# Altium schematic sheet Callisto Control Board.SchDoc
size A3; SheetNumber: 1; SheetTotal: 10
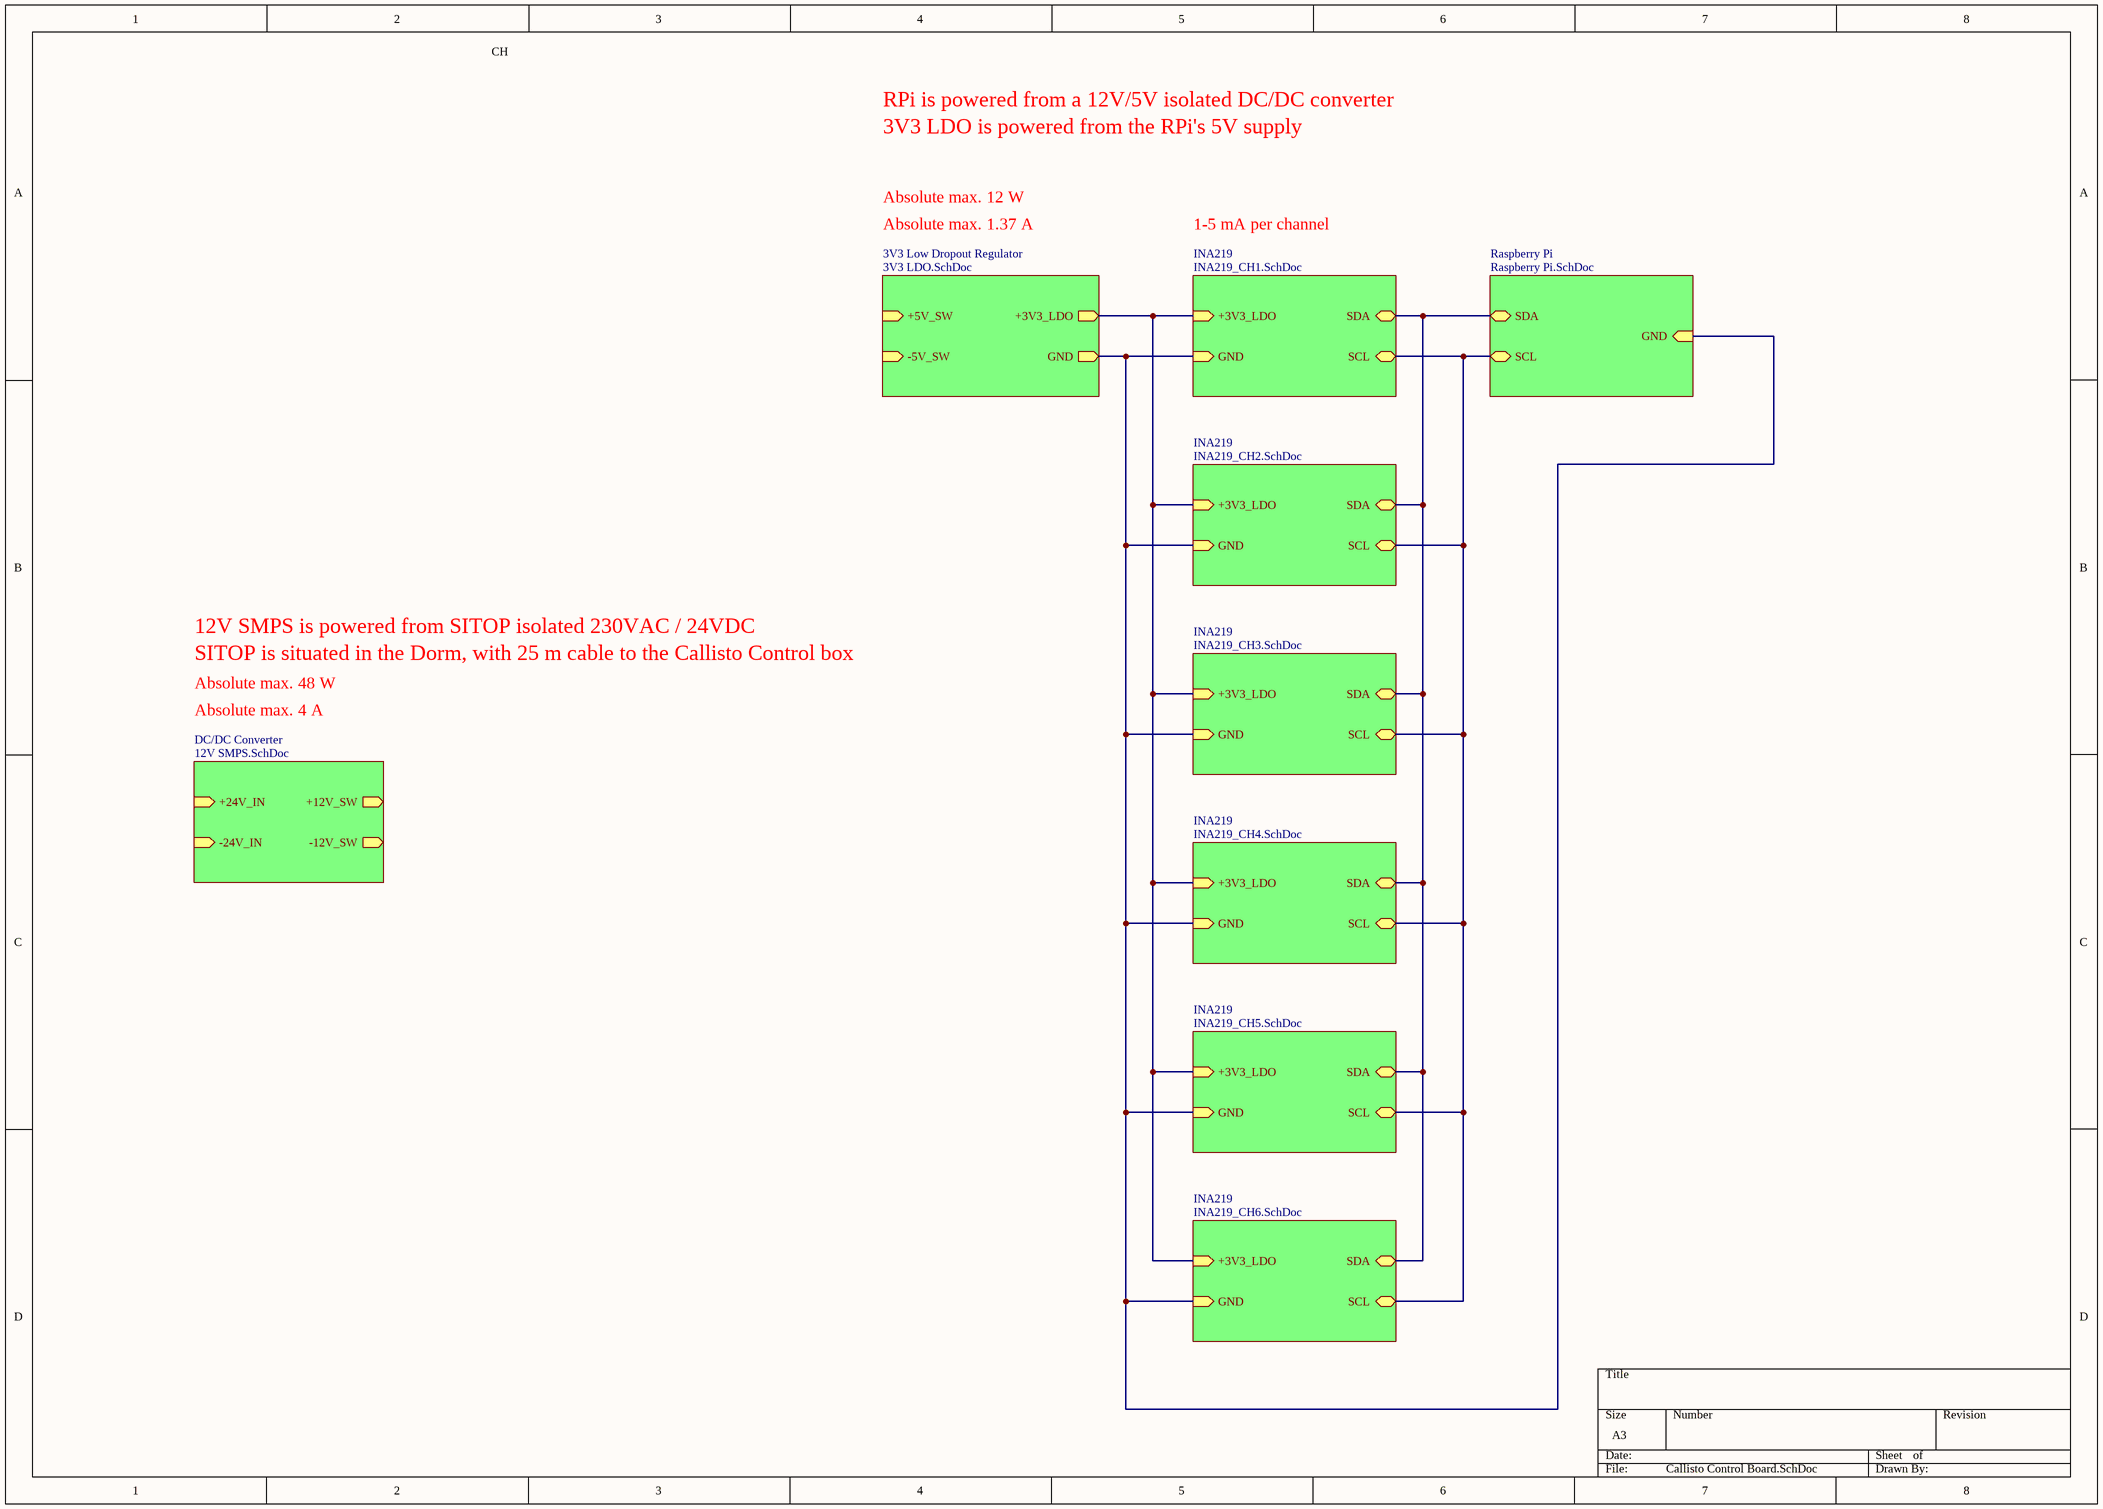
[diagram p0: Callisto Control Board.SchDoc]

## Sub-sheets
3V3 Low Dropout Regulator = 3V3 LDO.SchDoc: +3V3_LDO (out), GND (out), +5V_SW (in), -5V_SW (in)
DC/DC Converter = 12V SMPS.SchDoc: +24V_IN (in), -24V_IN (in), +12V_SW (out), -12V_SW (out)
INA219 = INA219_CH1.SchDoc: SDA (bidir), SCL (bidir), +3V3_LDO (in), GND (in)
INA219 = INA219_CH2.SchDoc: SDA (bidir), SCL (bidir), +3V3_LDO (in), GND (in)
INA219 = INA219_CH3.SchDoc: SDA (bidir), SCL (bidir), +3V3_LDO (in), GND (in)
INA219 = INA219_CH4.SchDoc: SDA (bidir), SCL (bidir), +3V3_LDO (in), GND (in)
INA219 = INA219_CH5.SchDoc: SDA (bidir), SCL (bidir), +3V3_LDO (in), GND (in)
INA219 = INA219_CH6.SchDoc: SDA (bidir), SCL (bidir), +3V3_LDO (in), GND (in)
Raspberry Pi = Raspberry Pi.SchDoc: SDA (bidir), SCL (bidir), GND (in)

## Nets
(unnamed): sheet INA219/SDA, sheet INA219/SDA, sheet INA219/SDA, sheet INA219/SDA, sheet INA219/SDA, sheet INA219/SDA, sheet Raspberry Pi/SDA
(unnamed): sheet INA219/SCL, sheet INA219/SCL, sheet INA219/SCL, sheet INA219/SCL, sheet INA219/SCL, sheet INA219/SCL, sheet Raspberry Pi/SCL
(unnamed): sheet INA219/+3V3_LDO, sheet 3V3 Low Dropout Regulator/+3V3_LDO, sheet INA219/+3V3_LDO, sheet INA219/+3V3_LDO, sheet INA219/+3V3_LDO, sheet INA219/+3V3_LDO, sheet INA219/+3V3_LDO
(unnamed): sheet INA219/GND, sheet 3V3 Low Dropout Regulator/GND, sheet INA219/GND, sheet INA219/GND, sheet INA219/GND, sheet INA219/GND, sheet INA219/GND, sheet Raspberry Pi/GND

## Notes on the sheet
- CH
- RPi is powered from a 12V/5V isolated DC/DC converter
- 3V3 LDO is powered from the RPi's 5V supply
- Absolute max. 12 W
- Absolute max. 1.37 A
- 1-5 mA per channel
- 12V SMPS is powered from SITOP isolated 230VAC / 24VDC
- Absolute max. 48 W
- Absolute max. 4 A
- SITOP is situated in the Dorm, with 25 m cable to the Callisto Control box